# Altium project SIM800C_Board.PrjPcb
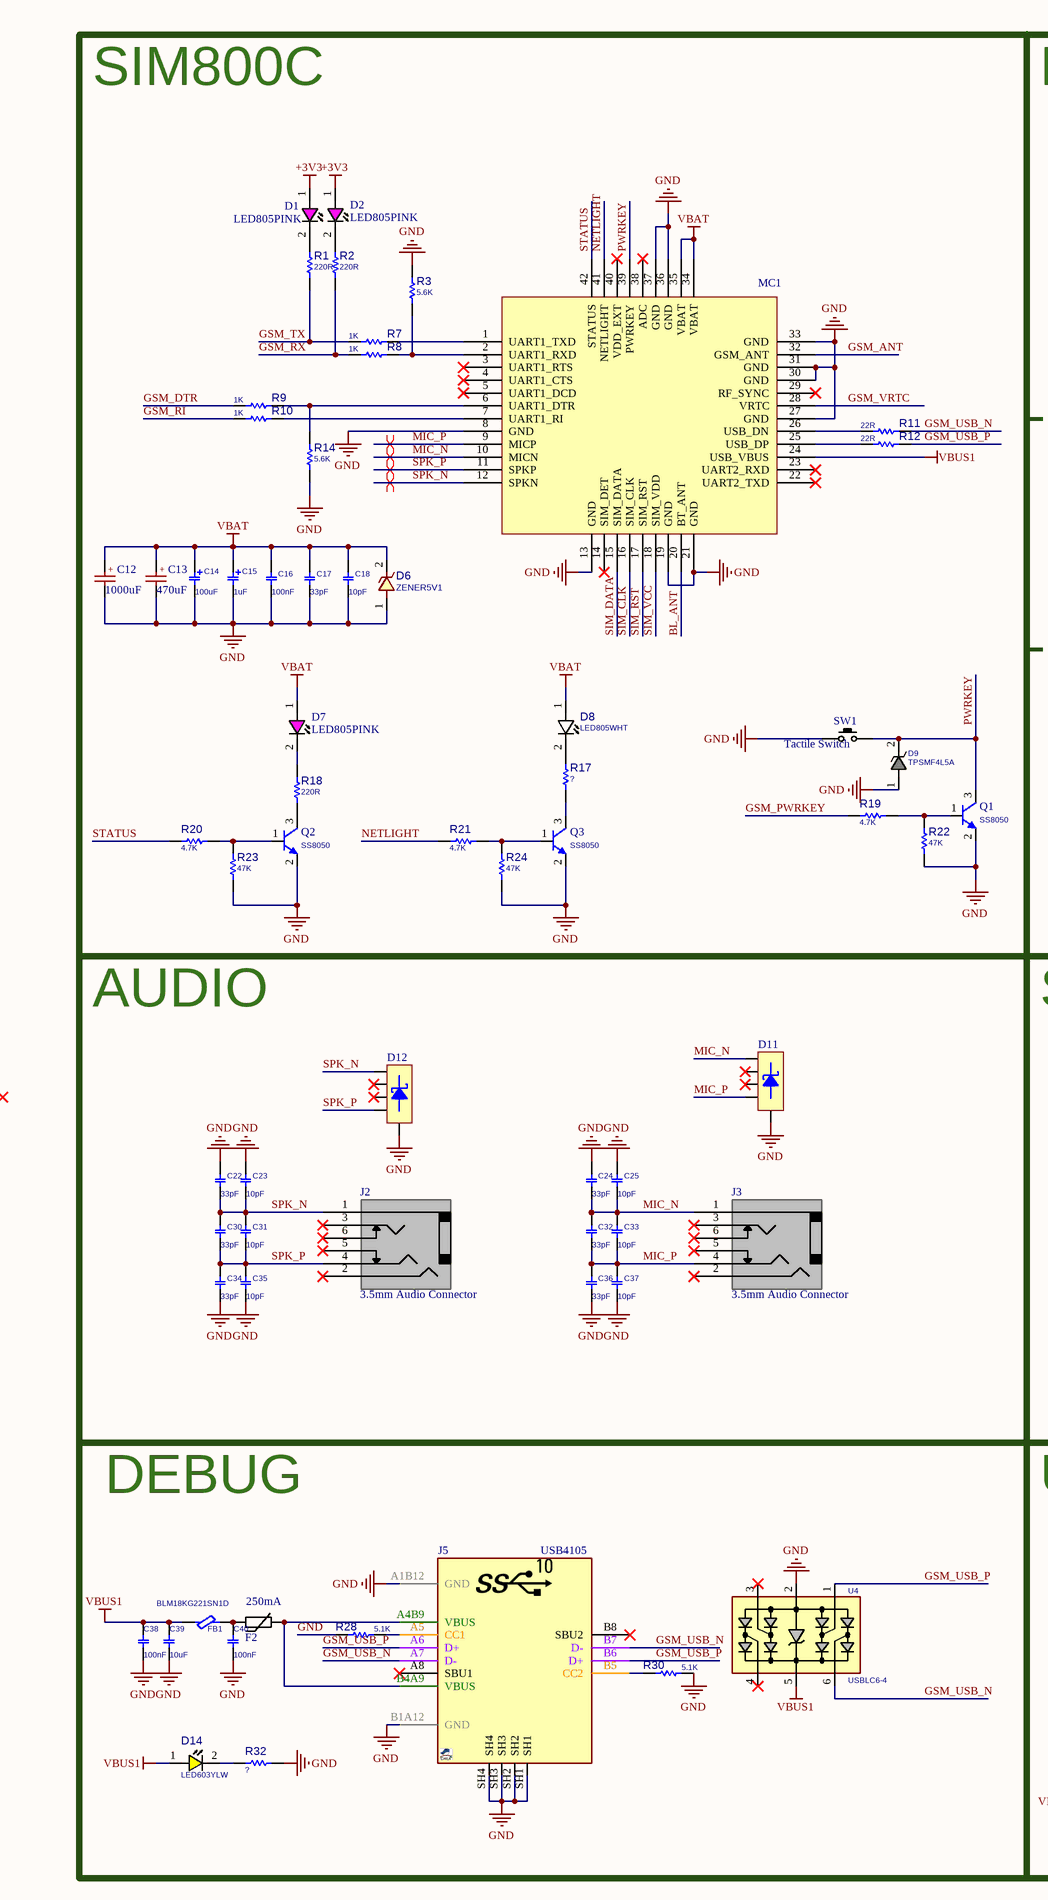
[diagram p0: SIM800C_BoardSCH.SchDoc, left]
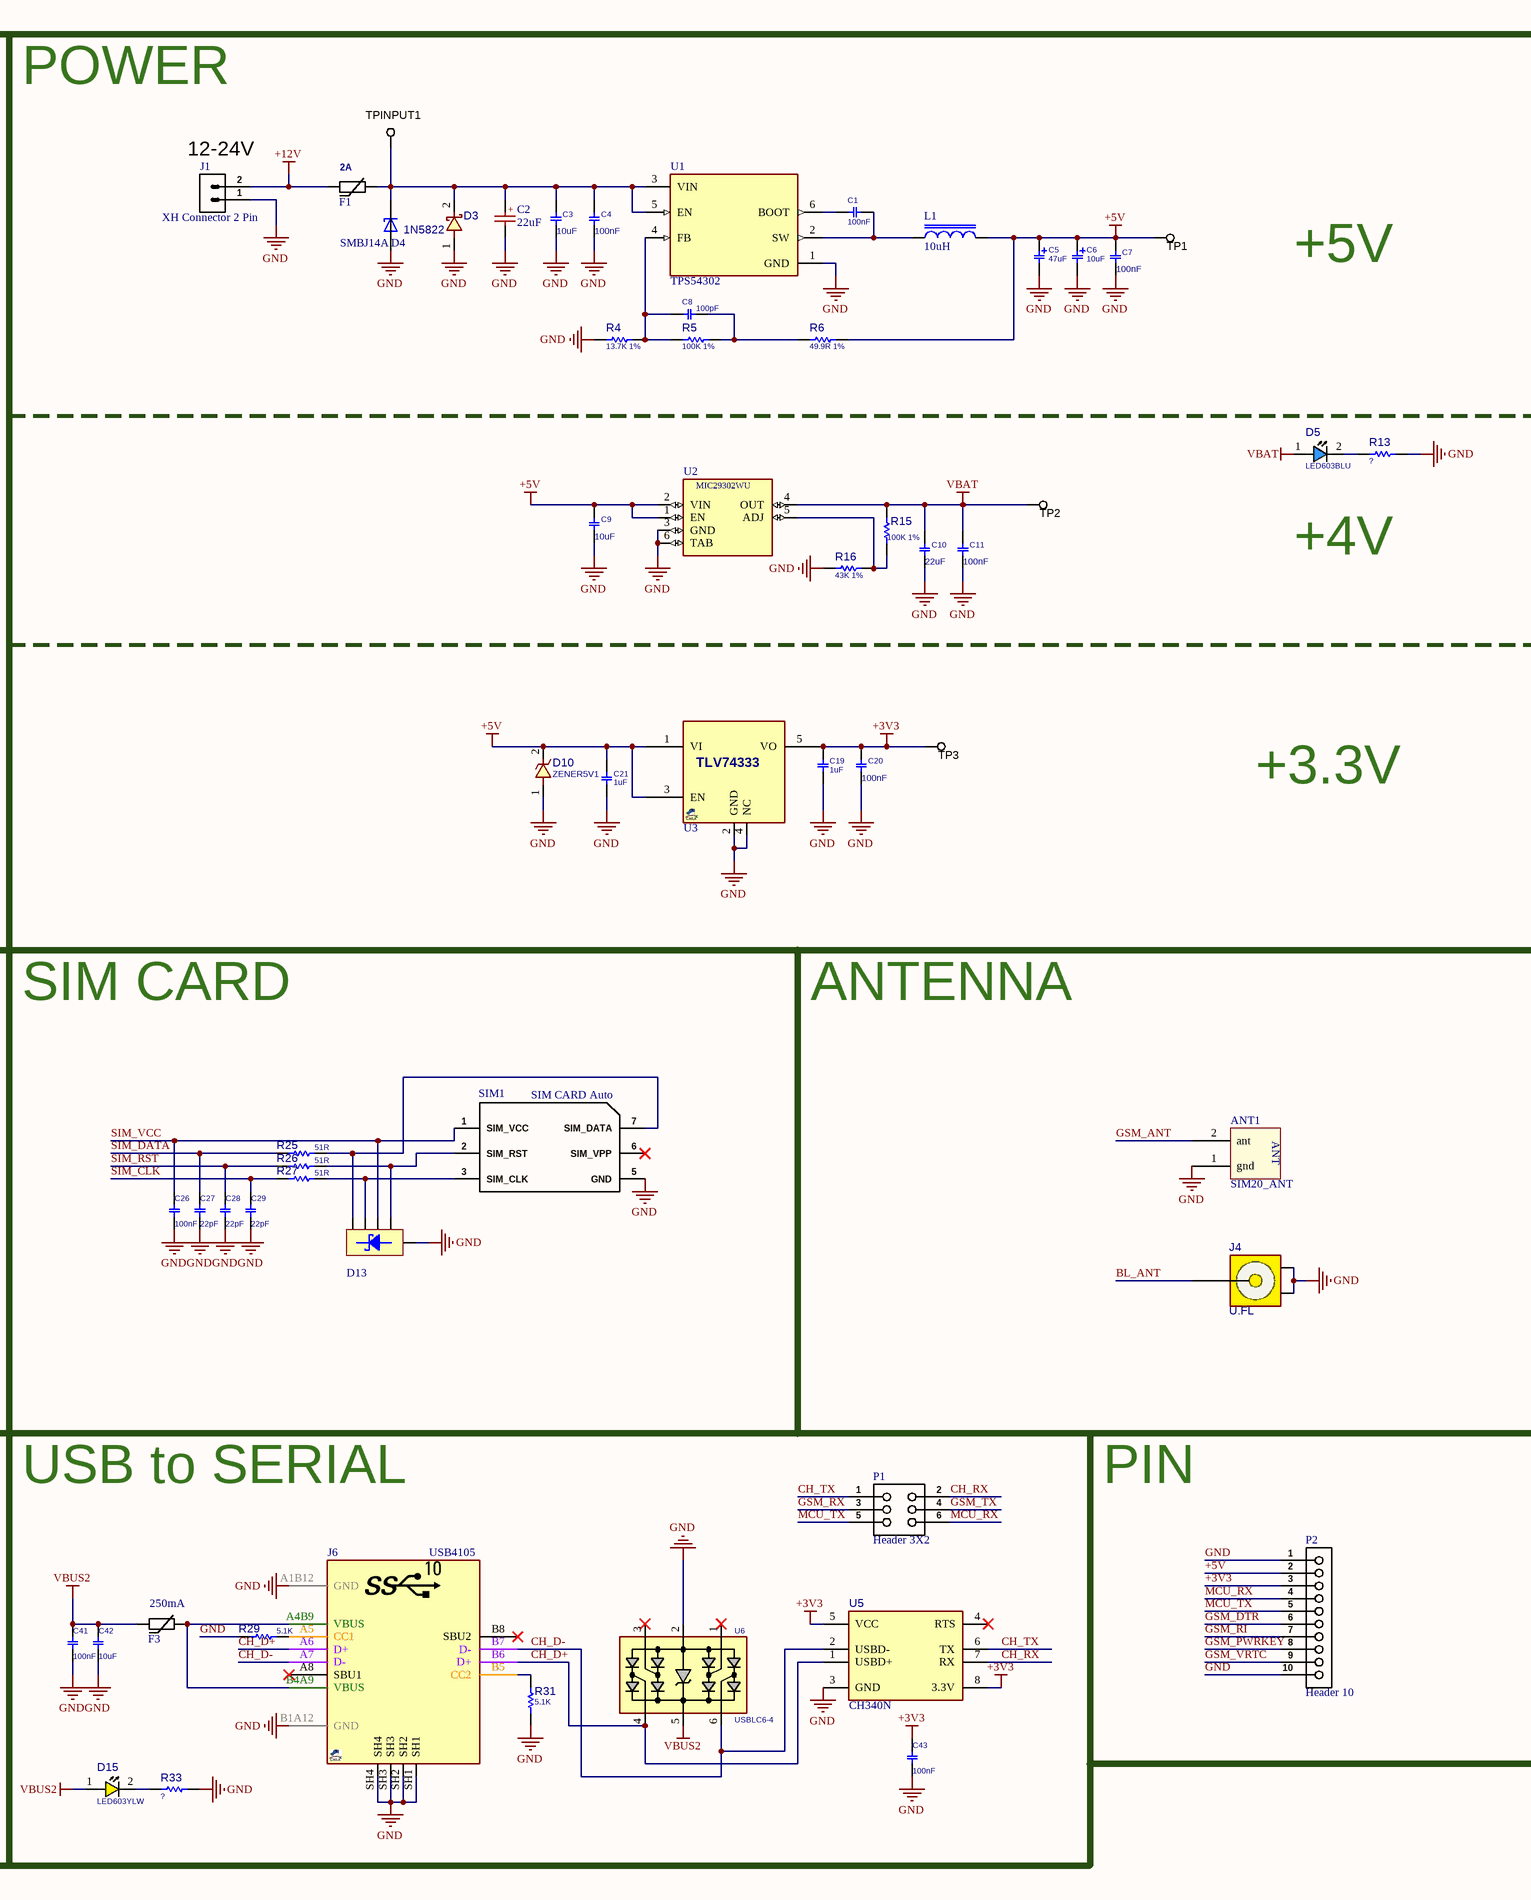
[diagram p1: SIM800C_BoardSCH.SchDoc, right]
1 sheet, 121 parts. Net scope: global (net labels, ports and power ports of the same name join across sheets).
Board file: SIM800C_BoardPCB.PcbDoc

## Sheet SIM800C_BoardSCH.SchDoc
size C; SheetNumber: 1; SheetTotal: 1

### Parts
ANT1  SIM20_ANT  [MY_SIM20_ANT]
C1  100nF  [C0603]
C2  22uF  [Cap SMD 6.3x5.4mm]
C3  10uF  [C1206]
C4  100nF  [C1206]
C5  47uF  [C_TN_3216]
C6  10uF  [C_TN_3216]
C7  100nF  [C1206]
C8  100pF  [C0603]
C9  10uF  [C1206]
C10  22uF  [C1206]
C11  100nF  [C1206]
C12  1000uF  [Cap SMD 8x10mm]
C13  470uF  [Cap SMD 6.3x7.7mm]
C14  100uF  [C_TN_3528_BLK]
C15  1uF  [C_TN_3216]
C16  100nF  [C0603]
C17  33pF  [C0603]
C18  10pF  [C0603]
C19  1uF  [C1206]
C20  100nF  [C1206]
C21  1uF  [C1206]
C22  33pF  [C0603]
C23  10pF  [C0603]
C24  33pF  [C0603]
C25  10pF  [C0603]
C26  100nF  [C0603]
C27  22pF  [C0603]
C28  22pF  [C0603]
C29  22pF  [C0603]
C30  33pF  [C0603]
C31  10pF  [C0603]
C32  33pF  [C0603]
C33  10pF  [C0603]
C34  33pF  [C0603]
C35  10pF  [C0603]
C36  33pF  [C0603]
C37  10pF  [C0603]
C38  100nF  [C0603]
C39  10uF  [C0603]
C40  100nF  [C0603]
C41  100nF  [C0603]
C42  10uF  [C0603]
C43  100nF  [C0603]
D1  LED805PINK  [LED_Pink_0805]
D2  LED805PINK  [LED_Pink_0805]
D3  1N5822  [D_SMA]
D4  SMBJ14A  [SMBJ14A]
D5  LED603BLU  [LED0603BLU]
D6  ZENER5V1  [D_SOD123W]
D7  LED805PINK  [LED_Pink_0805]
D8  LED805WHT  [LED0805WHT]
D9  TPSMF4L5A  [D_SOD123W]
D10  ZENER5V1  [D_SOD123W]
D11  SMF-05  [SC70-5_N]  (value not drawn)
D12  SMF-05  [SC70-5_N]  (value not drawn)
D13  SMF-05  [SC70-5_N]  (value not drawn)
D14  LED603YLW  [LED0603YLW]
D15  LED603YLW  [LED0603YLW]
F1  2A  [FUSE1206 (3216)]
F2  250mA  [FUSE0603 (1608)]
F3  250mA  [FUSE0603 (1608)]
FB1  BLM18KG221SN1D  [L0603]
J1  XH Connector 2 Pin  [XH 2 Pin Right (CWF) - 2.5mm]
J2  3.5mm Audio Connector  [PJ311D]
J3  3.5mm Audio Connector  [PJ311D]
J4  U.FL  [UFL]
J5  USB4105  [USBC_SMD_16_USB4105]
J6  USB4105  [USBC_SMD_16_USB4105]
L1  10uH  [SMD Inductor 1]
MC1  Sim800C  [SIM800C]  (value not drawn)
P1  Header 3X2  [HDR 2X3 Male Top]
P2  Header 10  [HDR 1X10 Male Top]
Q1  SS8050  [SOT23_3]
Q2  SS8050  [SOT23_3]
Q3  SS8050  [SOT23_3]
R1  220R  [R0603]
R2  220R  [R0603]
R3  5.6K  [R0603]
R4  13.7K 1%  [R0603]
R5  100K 1%  [R0603]
R6  49.9R 1%  [R0603]
R7  1K  [R0603]
R8  1K  [R0603]
R9  1K  [R0603]
R10  1K  [R0603]
R11  22R  [R0603]
R12  22R  [R0603]
R13  ?  [R0603]
R14  5.6K  [R0603]
R15  100K 1%  [R0603]
R16  43K 1%  [R0603]
R17  ?  [R0603]
R18  220R  [R0603]
R19  4.7K  [R0603]
R20  4.7K  [R0603]
R21  4.7K  [R0603]
R22  47K  [R0603]
R23  47K  [R0603]
R24  47K  [R0603]
R25  51R  [R0603]
R26  51R  [R0603]
R27  51R  [R0603]
R28  5.1K  [R0603]
R29  5.1K  [R0603]
R30  5.1K  [R0603]
R31  5.1K  [R0603]
R32  ?  [R0603]
R33  ?  [R0603]
SIM1  SIM CARD Auto  [SIM CARD MICRO 6 PIN AUTO 1]
SW1  Tactile Switch  [Tactile Switch]
TP1  TESTPOINT_SMD  [TPSMD_S1]  (value not drawn)  (no BOM)
TP2  TESTPOINT_SMD  [TPSMD_S1]  (value not drawn)  (no BOM)
TP3  TESTPOINT_SMD  [TPSMD_S1]  (value not drawn)  (no BOM)
TPINPUT1  TESTPOINT_SMD  [TPSMD_S1]  (value not drawn)  (no BOM)
U1  TPS54302  [TPS54302]
U2  MIC29302  [MIC29302]  (value not drawn)
U3  TLV74333  [SOT23_5]  (value not drawn)
U4  USBLC6-4  [SOT23_6]
U5  CH340N  [SO8_narrow_N]
U6  USBLC6-4  [SOT23_6]

### Blocks framed on the sheet
SIM800C: C12-C18 D1 D2 D6-D9 MC1 Q1-Q3 R1-R3 R7-R12 R14 R17-R24 SW1

### Nets
+3V3: C19.1 C20.2 C43.2 D1.1(ANODE) D2.1(ANODE) P2.3 TP3.1 U3.5(VO) U5.5(VCC) U5.8(3.3V)
+5V: C5.1 C6.1 C7.2 C9.2 C21.1 D10.2 L1.2 P2.2 R6.2 TP1.1 U2.1(EN) U2.2(VIN) U3.1(VI) U3.3(EN)
+12V: F1.1 J1.2
GND: ANT1.1(gnd) C2.2(-) C3.1 C4.1 C5.2 C6.2 C7.1 C9.1 C10.1 C11.1 C12.2(-) C13.2(-) C14.2 C15.2 C16.1 C17.1 C18.1 C19.2 C20.1 C21.2 C22.2 C23.2 C24.2 C25.2 C26.1 C27.1 C28.1 C29.1 C34.1 C35.1 C36.1 C37.1 C38.1 C39.1 C40.1 C41.1 C42.1 C43.1 D3.1 D4.A D6.1 D9.1 D10.1 D11.2(K) D12.2(K) D13.2(K) J1.1 J4.2(G1) J4.3(G2) J5.A1B12(GND) J5.B1A12(GND) J5.SH1 J5.SH2 J5.SH3 J5.SH4 J6.A1B12(GND) J6.B1A12(GND) J6.SH1 J6.SH2 J6.SH3 J6.SH4 MC1.8(GND) MC1.13(GND) MC1.19(GND) MC1.21(GND) MC1.27(GND) MC1.30(GND) MC1.31(GND) MC1.33(GND) MC1.36(GND) MC1.37(GND) P2.1 P2.10 Q1.2(E) Q2.2(E) Q3.2(E) R3.1 R4.1 R13.1 R14.1 R16.1 R22.1 R23.1 R24.1 R28.1 R29.1 R30.2 R31.2 R32.1 R33.1 SIM1.5(GND) SW1.1(P1) U1.1(GND) U2.3(GND) U2.6(TAB) U3.2(GND) U3.4(NC) U4.2 U5.3(GND) U6.2
VBAT: C10.2 C11.2 C12.1(+) C13.1(+) C14.1 C15.1 C16.2 C17.2 C18.2 D5.1(ANODE) D6.2 D7.1(ANODE) D8.1(ANODE) MC1.34(VBAT) MC1.35(VBAT) R15.2 TP2.1 U2.4(OUT)
VBUS1: C38.2 C39.2 D14.1(ANODE) FB1.1 MC1.24(USB_VBUS) U4.5
VBUS2: C41.2 C42.2 D15.1(ANODE) F3.1 U6.5
BL_ANT: J4.1(SIG) MC1.20(BT_ANT)
CH_D+: J6.A6(D+) J6.B6(D+) U5.1(USBD+) U6.4
CH_D-: J6.A7(D-) J6.B7(D-) U5.2(USBD-) U6.6
CH_RX: P1.2 U5.7(RX)
CH_TX: P1.1 U5.6(TX)
GSM_ANT: ANT1.2(ant) MC1.32(GSM_ANT)
GSM_DTR: P2.6 R9.2
GSM_PWRKEY: P2.8 R19.1
GSM_RI: P2.7 R10.2
GSM_RX: P1.3 R2.2 R8.2
GSM_TX: P1.4 R1.2 R7.2
GSM_USB_N: J5.A7(D-) J5.B7(D-) R11.1 U4.6
GSM_USB_P: J5.A6(D+) J5.B6(D+) R12.1 U4.1
GSM_VRTC: MC1.28(VRTC) P2.9
MCU_RX: P1.6 P2.4
MCU_TX: P1.5 P2.5
MIC_N: C24.1 C25.1 C32.2 C33.2 D11.1(K) J3.1(MIC) MC1.10(MICN)
MIC_P: C32.1 C33.1 C36.2 C37.2 D11.5(K) J3.4(SP_Left_OUT) MC1.9(MICP)
NETLIGHT: MC1.41(NETLIGHT) R21.1
PWRKEY: D9.2 MC1.39(PWRKEY) Q1.3(C) SW1.2(P3)
SIM_CLK: C29.2 MC1.16(SIM_CLK) R27.2
SIM_DATA: C27.2 MC1.15(SIM_DATA) R25.2
SIM_RST: C28.2 MC1.17(SIM_RST) R26.2
SIM_VCC: C26.2 D13.4(K) MC1.18(SIM_VDD) SIM1.1(SIM_VCC)
SPK_N: C22.1 C23.1 C30.2 C31.2 D12.1(K) J2.1(MIC) MC1.12(SPKN)
SPK_P: C30.1 C31.1 C34.2 C35.2 D12.5(K) J2.4(SP_Left_OUT) MC1.11(SPKP)
STATUS: MC1.42(STATUS) R20.1
NetC1_1: C1.1 U1.6(BOOT)
NetC1_2: C1.2 L1.1 U1.2(SW)
NetC2_1: C2.1(+) C3.2 C4.2 D3.2 D4.C F1.2 TPINPUT1.1 U1.3(VIN) U1.5(EN)
NetC8_1: C8.1 R4.2 R5.1 U1.4(FB)
NetC8_2: C8.2 R5.2 R6.1
NetC40_2: C40.2 F2.1 FB1.2
NetD1_2: D1.2(CATHODE) R1.1
NetD2_2: D2.2(CATHODE) R2.1
NetD5_2: D5.2(CATHODE) R13.2
NetD7_2: D7.2(CATHODE) R18.2
NetD8_2: D8.2(CATHODE) R17.2
NetD13_1: D13.1(K) R25.1 SIM1.7(SIM_DATA)
NetD13_3: D13.3(K) R27.1 SIM1.3(SIM_CLK)
NetD13_5: D13.5(K) R26.1 SIM1.2(SIM_RST)
NetD14_2: D14.2(CATHODE) R32.2
NetD15_2: D15.2(CATHODE) R33.2
NetF2_2: F2.2 J5.A4B9(VBUS) J5.B4A9(VBUS)
NetF3_2: F3.2 J6.A4B9(VBUS) J6.B4A9(VBUS)
NetJ5_A5: J5.A5(CC1) R28.2
NetJ5_B5: J5.B5(CC2) R30.1
NetJ6_A5: J6.A5(CC1) R29.2
NetJ6_B5: J6.B5(CC2) R31.1
NetMC1_1: MC1.1(UART1_TXD) R7.1
NetMC1_2: MC1.2(UART1_RXD) R3.2 R8.1
NetMC1_6: MC1.6(UART1_DTR) R9.1 R14.2
NetMC1_7: MC1.7(UART1_RI) R10.1
NetMC1_25: MC1.25(USB_DP) R12.2
NetMC1_26: MC1.26(USB_DN) R11.2
NetQ1_1: Q1.1(B) R19.2 R22.2
NetQ2_1: Q2.1(B) R20.2 R23.2
NetQ2_3: Q2.3(C) R18.1
NetQ3_1: Q3.1(B) R21.2 R24.2
NetQ3_3: Q3.3(C) R17.1
NetR15_1: R15.1 R16.2 U2.5(ADJ)

Not connected (* = marked no-connect by the designer): D11 3(K)* 4(K)*; D12 3(K)* 4(K)*; J2 2(GND)* 3(SP_Right_OUT)* 5(SP_Left_IN)* 6(SP_Right_IN)*; J3 2(GND)* 3(SP_Right_OUT)* 5(SP_Left_IN)* 6(SP_Right_IN)*; J5 A8(SBU1)* B8(SBU2)*; J6 A8(SBU1)* B8(SBU2)*; MC1 3(UART1_RTS)* 4(UART1_CTS)* 5(UART1_DCD)* 14(SIM_DET)* 22(UART2_TXD)* 23(UART2_RXD)* 29(RF_SYNC)* 38(ADC)* 40(VDD_EXT)*; SIM1 6(SIM_VPP)*; U4 3* 4*; U5 4(RTS)*; U6 1* 3*

### Layout directives
differential pair: MIC_N, MIC_P, SPK_N, SPK_P

### Notes on the sheet
- POWER
- (near J1) 12-24V
- +5V
- +4V
- +3.3V
- AUDIO
- SIM CARD
- ANTENNA
- DEBUG
- USB to SERIAL
- PIN
- (in symbol MIC29302) MIC29302WU

### Library data of the parts
ANT1 = SIM20_ANT: ANT
C1 C8 C16-C18 C22-C43 = CAP_SMD_MLCC_0603: CAP, MLCC, -F, -V, MATERIAL, -%, 0201; PARAM: -, -%; MANF_P#: MANF_PART#; PRICE: 100= 1$; MANF: -; PARAM2: -V; ASSEMBLY: ASSEMBLY
  C1 C16 C26 C38 C40 C41 C43: VALUE: 100nF
  C8: VALUE: 100pF
  C17 C22 C24 C30 C32 C34 C36: VALUE: 33pF
  C18 C23 C25 C31 C33 C35 C37: VALUE: 10pF
  C27-C29: VALUE: 22pF
  C39 C42: VALUE: 10uF
C2 C12 C13 = CAP Electrolytic SMD: SMD Aluminum Electrolytic Capacitor; Desc: SMD Aluminum Electrolytic Capacitors; Value: 100uF; Voltage: 12v; Tolerance: 5%; Library Link: https://github.com/Majid-Derhambakhsh; Publisher: Majid Derhambakhsh
C3 C4 C7 C9-C11 C20 = CAP_SMD_MLCC_1206: CAP, MLCC; PARAM: -, -%; MANF_P#: MANF_PART#; PARAM2: -V; PRICE: 100= 1$; MANF: -; ASSEMBLY: ASSEMBLY
C5 C6 C15 = CAP_SMD_TAN: CAP, SMD, TAN,; PARAM2: -V
  C5: VALUE: 47uF
  C6: VALUE: 10uF
  C15: VALUE: 1uF
C14 = CAP_SMD_TAN_4: CAP, SMD, TAN; PARAM: 20%, 300mOhm, -55~105oC; MANF: VISHAY; MANF_P#: T55A106M6R3C0300; PARAM2: 6.3V; PRICE: 0.46$; VALUE: 100uF
C19 C21 = CAP_SMD_MLCC_1206: CAP, MLCC, -F, -V, MATERIAL, -%, 0201; PARAM: -, -%; MANF_P#: MANF_PART#; PRICE: 100= 1$; MANF: -; PARAM2: -V; ASSEMBLY: ASSEMBLY; VALUE: 1uF
D1 D2 D7 = LED_Pink: LED, SMD, 0805, PINK
D3 = DIODE_SMD_SCHOTTKY_1N5822: DIODE, SCHOTTKY, 40V, 3A; MANF: DIODES; DESC: DESCRIPTION; MANF_P#: 1N5822; ASSEMBLY: ASSEMBLY; PRICE: PRICE; PARAM2: 3A; PARAM: 40V; VALUE: 1N5822
D4 = SMBJ14A: TVS Diode Uni-directional 14V SMB
D5 = LED_SMD_0603_BLU: LED, SMD, 0603, BLUE; PARAM: 30mA, 470nm, 120° Angle; DESC: DESCRIPTION; MANF_P#: MANF_PART#; PARAM2: 2.2~3V; MANF: MANF; ASSEMBLY: ASSEMBLY; PRICE: PRICE; VALUE: LED603BLU
D6 D10 = DIODE_SMD_ZENER_BZT52HC5V1: DIODE, ZENER, 1W, 5.1V; MANF: Diodes; DESC: DESCRIPTION; PARAM2: 1W, 4Ohm, -55~150oC; MANF_P#: BZT52HC5V1WF-7; ASSEMBLY: ASSEMBLY; PRICE: 0.25$; PARAM: 5.1V; VALUE: ZENER5V1
D8 = LED_SMD_0805_WHT: LED, SMD, 0805, WHITE; DESC: DESCRIPTION; MANF_P#: MANF_PART#; PARAM2: 2.2V; MANF: MANF; ASSEMBLY: ASSEMBLY; PRICE: 36t@Javan; VALUE: LED805WHT
D9 = TVS_TPSMF4L33A: TVS, ESD PROTECT; MANF: Littelfuse; PARAM2: 33.7VRWM, 37VBR; PARAM: -55~150°C; MANF_P#: TPSMF4L33A; PRICE: 0.5$; VALUE: TPSMF4L5A
D11-D13 = Semi_Diod_TVS_SMF05: TVS Diode Array; Rating: Rating?; Validation: Valid; Inflow: inflow?; Type: TVS; Value: SMF-05; Package: SC70-5
D14 D15 = LED_SMD_0603_YLW: LED, SMD, 0603, YELLOW; DESC: DESCRIPTION; MANF_P#: MANF_PART#; PARAM2: 2.2V; MANF: MANF; ASSEMBLY: ASSEMBLY; PRICE: PRICE; VALUE: LED603YLW
F1-F3 = PPTC Resettable Fuses: Publisher: Majid Derhambakhsh
  F1: Value: 2A
  F2 F3: Value: 250mA
FB1 = FBEAD_SMD_BLM18PG121: FERRITE_Bead, 0603, 2A, 50mOhm, 120@100MHz; MANF: MURATA; MANF_P#: BLM18PG121SN1D; PARAM: 120@100MHz; PARAM2: 2A, 50mOhm; VALUE: BLM18KG221SN1D
J1 = XH 2: XH, 2-Pin; Current: 3A; Library Link: https://github.com/Majid-Derhambakhsh; Publisher: Majid Derhambakhsh
J2 J3 = PJ311D
J4 = CONN_RF_UFL: CONN, RF, U.FL, STRAIGHT, Ultra Miniature Coaxial; MANF_P#: CONUFL001-SMD, U.FL-R-SMT-1(10), 128-0711-201; MANF: Linx, Hirose, Cinch; PARAM: 50Ohm, 6GHz; DESC: DESCRIPTION; DIST#: DIGIKEY, MOUSER; PARAM2: GOLD; ASSEMBLY: ASSEMBLY; PRICE: 0.9$; VALUE: U.FL
J5 J6 = CONN_USBC_SMD_16_USB4105: CONN, USB, Type C, USB 2.0, Right-Angle, SMD; MANF: GCT; MANF_P#: USB4105-GF-A; PARAM: 5A; Price: 1.5$; Value: USB4105
L1 = SMD Inductor 1: 1210 (3225)  Part number : DFE322512F-100M=P2
MC1 = ModSen_Com_Sim800C: SimCom GSM/GPRS Module; Rating: Rating?; Validation: NT; Inflow: inflow?; Value: Sim800C; Package: Package?; Type: Type?
P1 = Header 3X2: Header, 3-Pin, Dual row; Publisher: Majid Derhambakhsh; Library Link: https://github.com/Majid-Derhambakhsh
P2 = Header 10: Header, 10-Pin; Library Link: https://github.com/Majid-Derhambakhsh; Publisher: Majid Derhambakhsh
Q1-Q3 = NPN_SS8050_SOT23: BJT, NPN, 25v, 1.5A, SMD, SOT23; PARAM2: 300mW; MANF: GALAXY; PARAM: 25v, 1.5A; MANF_P#: SS8050; VALUE: SS8050
R1-R3 R7-R14 R17-R33 = RES_SMD_0603: RESISTOR, SMD; PARAM: -W; DESC: DESCRIPTION; DIST#: MOUSER; PARAM2: 1%; MANF_P#: -; MANF: -; ASSEMBLY: ASSEMBLY; PRICE: 100= 0.5$
  R1 R2 R18: VALUE: 220R
  R3 R14: VALUE: 5.6K
  R7-R10: VALUE: 1K
  R11 R12: VALUE: 22R
  R13 R17 R32 R33: VALUE: ?
  R19-R21: VALUE: 4.7K
  R22-R24: VALUE: 47K
  R25-R27: VALUE: 51R
  R28-R31: VALUE: 5.1K
R4-R6 R15 R16 = RES_SMD_0603: RESISTOR, SMD; PARAM: -W; DESC: DESCRIPTION; DIST#: MOUSER; MANF_P#: -; MANF: -; ASSEMBLY: ASSEMBLY; PRICE: 100= 0.5$; PARAM2: 1%
  R4: VALUE: 13.7K 1%
  R5 R15: VALUE: 100K 1%
  R6: VALUE: 49.9R 1%
  R16: VALUE: 43K 1%
SIM1 = SIM CARD micro auto: SIM CARD 6 Pin Auto; Library Link: https://github.com/Majid-Derhambakhsh; Publisher: Majid Derhambakhsh
SW1 = Tactile Switch: 3x6x5 mm - 2 Pin
TP1-TP3 TPINPUT1 = TESTPOINT_SMD: TEST POINT; MANF: MANF; MANF_P#: MANF_P#; VALUE: VALUE
U1 = TPS54302: 4.5-V to 28-V Input, 3-A Output, EMI Friendly / Synchronous Step-Down Converter
U2 = MIC29302: Linear Voltage Regulator IC 1 Output 3A TO-263-5
U3 = VREG_TLV74333_SOT23: REG, Linear, LDO0.12V, Fixed, 300mA, VIN1.4~5.5V, VOUT1~5.5V, SOT-23-5; MANF: Texas Instruments; MANF_P#: TLV74333PDQN; PARAM2: 1.4~5.5Vin, LDO0.12V, Fixed3.0V; PARAM: 300mA, 50dB PSRR, -40~125°C; PRICE: $0.3; VALUE: TLV74333
U4 U6 = TVS_X4_USBLC6-4SC6: TVS, ESD PROTECT, 4CH; MANF: ST; MANF_P#: USBLC6-4SC6; VALUE: USBLC6-4
U5 = IC_Converter_CH340N: TTL To USB Chip; Rating: Rating?; Validation: Valid; Inflow: inflow?; Type: USB to TTL; Package: SO-8; Value: CH340N